# Altium schematic sheet Transceivers.SchDoc
size A; Organization: Machine Intelligence Laboratory; Address1: 1889 Museum Rd; Address2: Room 3001; Address3: Gainesville, FL, 32611; SheetNumber: 3; SheetTotal: 4
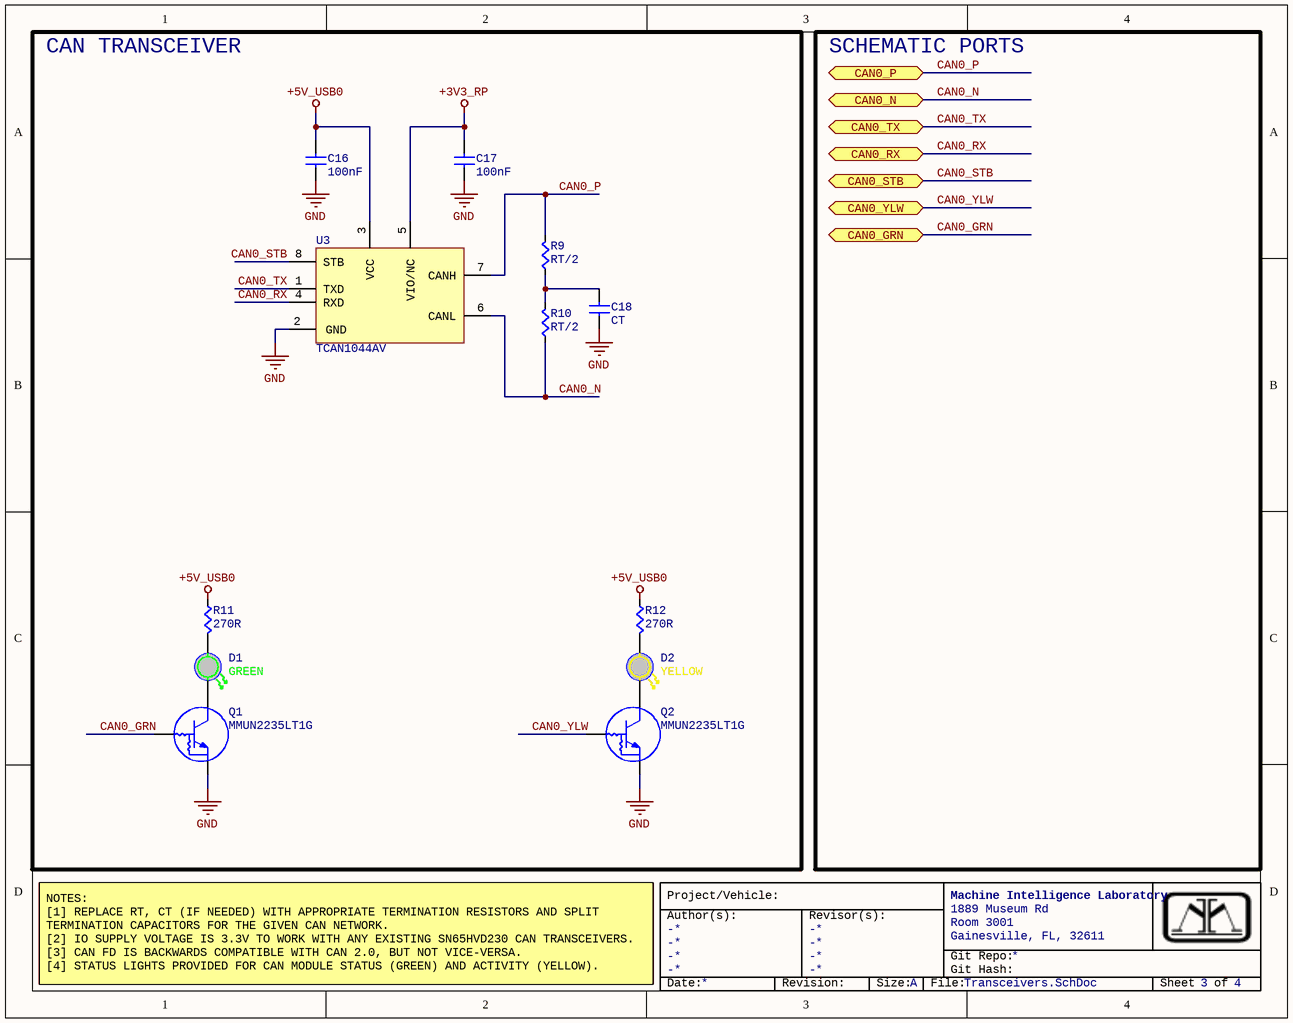
[diagram p0: Transceivers.SchDoc]

## Parts
C16  100nF  [CAPC0603]
C17  100nF  [CAPC0603]
C18  value CT  [CAPC0603]  (hidden comment: Cap)
D1  GREEN  [LED0603]
D2  YELLOW  [LED0603]
Q1  MMUN2235LT1G  [SOT-23-3]
Q2  MMUN2235LT1G  [SOT-23-3]
R9  value RT/2  [RES0603]  (hidden comment: Res)
R10  value RT/2  [RES0603]  (hidden comment: Res)
R11  270R  [RES0603]
R12  270R  [RES0603]
U3  TCAN1044AV  [SOT65P280X110-8N]

## Blocks framed on the sheet
CAN TRANSCEIVER: C16-C18 D1 D2 Q1 Q2 R9-R12 U3

## Ports
CAN0_GRN (bidir, see Connectors[8A], Microcontroller[2D]), CAN0_N (bidir, see Connectors[8A]), CAN0_P (bidir, see Connectors[8A]), CAN0_RX (bidir, see Microcontroller[2C]), CAN0_STB (bidir, see Microcontroller[2C]), CAN0_TX (bidir, see Microcontroller[2C]), CAN0_YLW (bidir, see Connectors[8B], Microcontroller[2C])

## Nets
+3V3_RP: C17.2(B) U3.5(VIO/NC)
+5V_USB0: C16.2(B) R11.2(B) R12.2(B) U3.3(VCC)
GND: C16.1(A) C17.1(A) C18.2(B) Q1.2(E) Q2.2(E) U3.2(GND)
CAN0_GRN: Q1.1(B) ; port CAN0_GRN
CAN0_N: R10.2(B) U3.6(CANL) ; port CAN0_N
CAN0_P: R9.1(A) U3.7(CANH) ; port CAN0_P
CAN0_RX: U3.4(RXD) ; port CAN0_RX
CAN0_STB: U3.8(STB) ; port CAN0_STB
CAN0_TX: U3.1(TXD) ; port CAN0_TX
CAN0_YLW: Q2.1(B) ; port CAN0_YLW
NetC18_1: C18.1(A) R9.2(B) R10.1(A)
NetD1_A: D1.A R11.1(A)
NetD1_C: D1.C Q1.3(C)
NetD2_A: D2.A R12.1(A)
NetD2_C: D2.C Q2.3(C)

## Notes on the sheet
- SCHEMATIC PORTS
- NOTES:
  [1] REPLACE RT, CT (IF NEEDED) WITH APPROPRIATE TERMINATION RESISTORS AND SPLIT TERMINATION CAPACITORS FOR THE GIVEN CAN NETWORK.
  [2] IO SUPPLY VOLTAGE IS 3.3V TO WORK WITH ANY EXISTING SN65HVD230 CAN TRANSCEIVERS.
  [3] CAN FD IS BACKWARDS COMPATIBLE WITH CAN 2.0, BUT NOT VICE-VERSA.
  [4] STATUS LIGHTS PROVIDED FOR CAN MODULE STATUS (GREEN) AND ACTIVITY (YELLOW).
- Project/Vehicle:
- PLACE NOTES BOX HERE
- Author(s):
- -
- Revisor(s):
- Git Repo:
- Git Hash:
- Date:
- Revision:
- Size:
- A
- File:
- Sheet
- of

## Library data of the parts
C16 C17 = CC0603KRX7R7BB104: Ceramic Capacitor, Multilayer, Cera; Manufacturer: Yageo; Multilayer: Yes; Tolerance  (fill in as +-): 10%; Rated DC Voltage (URdc): 16V; Temperature Characteristics Code: X7R; Part Number: CC0603KRX7R7BB104; Category: Ceramic Capacitors; Stock 1: 11347706; Pricing 1: 1=0.1, 10=0.042, 50=0.0238, 100=0.0; Mounting Technology: Surface Mount; Pins: 2; Package Shape: Rectangular; Case/Package: 0603; Terminal Finish: Nickel; Min Operating Temperature: -55°C; Max Operating Temperature: 125°C; JESD-609 Code: e3; Packaging: Tape and Reel; Value: 100nF; Termination: Wraparound; Reach SVHC Compliant: Yes; RoHS Compliant: Yes; ComponentLink1URL: https://datasheet.ciiva.com:443/pdf; ComponentLink1Description: https://datasheet.ciiva.com:443/pdf; ComponentLink2URL: https://datasheet.ciiva.com/11786/0; ComponentLink2Description: https://datasheet.ciiva.com/11786/0; ComponentLink3URL: https://datasheet.ciiva.com/8033/70; ComponentLink3Description: https://datasheet.ciiva.com/8033/70; ComponentLink4URL: https://datasheet.ciiva.com/7978/14; ComponentLink4Description: https://datasheet.ciiva.com/7978/14; ComponentLink5URL: https://datasheet.ciiva.com/28450/1; ComponentLink5Description: https://datasheet.ciiva.com/28450/1; ComponentLink6URL: https://datasheet.ciiva.com/46430/1; ComponentLink6Description: https://datasheet.ciiva.com/46430/1; ComponentLink7URL: https://datasheet.ciiva.com/144/mlc; ComponentLink7Description: https://datasheet.ciiva.com/144/mlc; ComponentLink8URL: https://datasheet.ciiva.com/144/mlc; ComponentLink8Description: https://datasheet.ciiva.com/144/mlc; ComponentLink9URL: https://datasheet.ciiva.com/144/mlc; ComponentLink9Description: https://datasheet.ciiva.com/144/mlc; Supplier Part Number 1: 311-1088-1-ND; Manufacturer Part Number: CC0603KRX7R7BB104; RoHS: Yes; Package Style: SMTMeter; Supplier 1: Digikey; Dielectric Material: Ceramic; Capacitor Type: Ceramic; Tolerance (fill in as +-): 10%; Length: 1.6mm; Width: 0.8mm; Height: 0.8mm; ComponentLink10URL: https://datasheet.ciiva.com/8033/17; ComponentLink10Description: https://datasheet.ciiva.com/8033/17; ComponentLink11URL: https://datasheet.ciiva.com/13395/u; ComponentLink11Description: https://datasheet.ciiva.com/13395/u; ComponentLink12URL: https://datasheet.ciiva.com/11464/u; ComponentLink12Description: https://datasheet.ciiva.com/11464/u; ComponentLink13URL: https://datasheet.ciiva.com/15165/g; ComponentLink13Description: https://datasheet.ciiva.com/15165/g; ComponentLink14URL: https://datasheet.ciiva.com:443/pdfs/VipMasterIC/IC/YAGO/YAGO-S-A0003557223; ComponentLink14Description: https://datasheet.ciiva.com:443/pdfs/VipMasterIC/IC/YAGO/YAGO-S-A0003557223; ComponentLink15URL: https://datasheet.ciiva.com/11786/0900766b80d84f1d-11786077.pdf?src-supplie; ComponentLink15Description: https://datasheet.ciiva.com/11786/0900766b80d84f1d-11786077.pdf?src-supplie; ComponentLink16URL: https://datasheet.ciiva.com/8033/70765-8033799.pdf?src-supplier=Element14; ComponentLink16Description: https://datasheet.ciiva.com/8033/70765-8033799.pdf?src-supplier=Element14; ComponentLink17URL: https://datasheet.ciiva.com/7978/1489800-7978141.pdf?src-supplier=Element14; ComponentLink17Description: https://datasheet.ciiva.com/7978/1489800-7978141.pdf?src-supplier=Element14; ComponentLink18URL: https://datasheet.ciiva.com/28450/1489800-28450552.pdf?src-supplier=Element
D1 = 150060VS75000: Single Color LED, Bright Green, Wat; Manufacturer: Wurth Electronics; Shape: Rectangular; Lens Style: WATER CLEAR; Forward Current: 30mA; Luminous Intensity-Nom: 40mcd; Channels: 1; Viewing Angle: 140°; Overall Height: 0.7mm; Part Number: 150060VS75000; Category: LEDs; Stock 1: 38675; Pricing 1: 1=0.15, 50=0.142, 100=0.122, 500=0.; Mounting Technology: Surface Mount; Pins: 2; Min Operating Temperature: -40°C; Max Operating Temperature: 85°C; Packaging: Tape and Reel; Reach SVHC Compliant: Yes; RoHS Compliant: Yes; ComponentLink1URL: https://datasheet.ciiva.com:443/pdf; ComponentLink1Description: https://datasheet.ciiva.com:443/pdf; ComponentLink2URL: https://datasheet.ciiva.com/29562/1; ComponentLink2Description: https://datasheet.ciiva.com/29562/1; Supplier Part Number 1: 732-4980-1-ND; Manufacturer Part Number: 150060VS75000; RoHS: Yes; Supplier 1: Digikey; Color: Green; Optoelectronic Device Type: SINGLE COLOR LED; Size: 1.1mm; Terminal Pitch: 1.6mm
D2 = 150060YS75000: Single Color LED, Yellow, Water Cle; Manufacturer: Wurth Electronics; Shape: Rectangular; Lens Style: WATER CLEAR; Forward Current: 30mA; Luminous Intensity-Nom: 120mcd; Channels: 1; Viewing Angle: 140°; Overall Height: 0.7mm; Part Number: 150060YS75000; Category: LEDs; Stock 1: 50357; Pricing 1: 1=0.15, 50=0.142, 100=0.122, 500=0.; Mounting Technology: Surface Mount; Pins: 2; Min Operating Temperature: -40°C; Max Operating Temperature: 85°C; Packaging: Tape and Reel; Reach SVHC Compliant: Yes; RoHS Compliant: Yes; ComponentLink1URL: https://datasheet.ciiva.com:443/pdf; ComponentLink1Description: https://datasheet.ciiva.com:443/pdf; ComponentLink2URL: https://datasheet.ciiva.com/23843/1; ComponentLink2Description: https://datasheet.ciiva.com/23843/1; ComponentLink3URL: https://datasheet.ciiva.com/29279/7; ComponentLink3Description: https://datasheet.ciiva.com/29279/7; ComponentLink4URL: https://datasheet.ciiva.com/22656/1; ComponentLink4Description: https://datasheet.ciiva.com/22656/1; ComponentLink5URL: https://datasheet.ciiva.com/29563/1; ComponentLink5Description: https://datasheet.ciiva.com/29563/1; ComponentLink6URL: https://datasheet.ciiva.com/29563/1; ComponentLink6Description: https://datasheet.ciiva.com/29563/1; ComponentLink7URL: https://datasheet.ciiva.com/48430/1; ComponentLink7Description: https://datasheet.ciiva.com/48430/1; Supplier Part Number 1: 732-4981-1-ND; Manufacturer Part Number: 150060YS75000; RoHS: Yes; Supplier 1: Digikey; Color: Yellow; Optoelectronic Device Type: SINGLE COLOR LED; Size: 1.1mm; Terminal Pitch: 1.6mm
Q1 Q2 = MMUN2235LT1G: Small Signal Bipolar Transistor, 0.; Manufacturer: ON Semiconductor; Package Body Material: Plastic; Transistor Element Material: SILICON; Polarity/Channel Type: NPN; Max Collector Current: 100mA; Collector-emitter Voltage-Max: 50V; DC Current Gain-Min (hFE): 80; Number of Elements: 1; Power Dissipation-Max (Abs): 400mW; Transistor Application: SWITCHING; JEDEC-95 Code: TO-236AB; Part Number: MMUN2235LT1G; Category: BJTs; Stock 1: 373000; Pricing 1: 1=0.1198, 10=0.0829, 100=0.035, 100; Pins: 3; Package Shape: Rectangular; Terminal Finish: Tin; JESD-609 Code: e3; Reach SVHC Compliant: Yes; RoHS Compliant: Yes; ComponentLink1URL: https://datasheet.ciiva.com:443/pdf; ComponentLink1Description: https://datasheet.ciiva.com:443/pdf; ComponentLink2URL: http://www.mouser.com/ds/2/308/DTC1; ComponentLink2Description: http://www.mouser.com/ds/2/308/DTC1; ComponentLink3URL: http://www.onsemi.com/pub/Collatera; ComponentLink3Description: http://www.onsemi.com/pub/Collatera; ComponentLink4URL: http://www.onsemi.com/pub/Collatera; ComponentLink4Description: http://www.onsemi.com/pub/Collatera; Supplier Part Number 1: MMUN2235LT1G; Manufacturer Part Number: MMUN2235LT1G; RoHS: Yes; Package Style: SMALL OUTLINEMeter; Supplier 1: Arrow Electronics; Moisture Sensitivity Level: 1; JESD-30 Code: R-PDSO-G3; Surface Mount: Yes; Terminal Form: Gull Wing; Terminal Position: DUAL
R11 R12 = RC0603FR-07270RL: Fixed Resistor, Metal Glaze/thick F; Manufacturer: Yageo; Power: 100mW; Rated Temperature: 70°C; Tolerance: 1%; Additional Feature: LASER TRIMMABLE; Temperature Coefficient: 100ppm/°C; Working Voltage: 75V; Package Height: 0.45mm; Package Length: 1.6mm; Package Width: 0.8mm; Part Number: RC0603FR-07270RL; Category: Chip SMD Resistors; Stock 1: 855000; Pricing 1: 5000=0.0015, 50000=0.0014, 150000=0; Mounting Technology: Surface Mount; Pins: 2; Package Shape: Rectangular; Case/Package: 0603; Terminal Finish: Nickel; Min Operating Temperature: -55°C; Max Operating Temperature: 155°C; JESD-609 Code: e3; Resistor Type: FIXED RESISTOR; Packaging: Tape and Reel; Value: 270R; Termination: Wraparound; Technology: METAL GLAZE/THICK FILM; Reach SVHC Compliant: Yes; RoHS Compliant: Yes; ComponentLink1URL: https://datasheet.ciiva.com:443/pdf; ComponentLink1Description: https://datasheet.ciiva.com:443/pdf; ComponentLink2URL: https://datasheet.ciiva.com/11808/0; ComponentLink2Description: https://datasheet.ciiva.com/11808/0; ComponentLink3URL: https://datasheet.ciiva.com/2455/py; ComponentLink3Description: https://datasheet.ciiva.com/2455/py; ComponentLink4URL: https://datasheet.ciiva.com/2455/py; ComponentLink4Description: https://datasheet.ciiva.com/2455/py; ComponentLink5URL: https://datasheet.ciiva.com/2455/py; ComponentLink5Description: https://datasheet.ciiva.com/2455/py; ComponentLink6URL: https://datasheet.ciiva.com/15189/g; ComponentLink6Description: https://datasheet.ciiva.com/15189/g; ComponentLink7URL: https://datasheet.ciiva.com/7746/44; ComponentLink7Description: https://datasheet.ciiva.com/7746/44; ComponentLink8URL: https://datasheet.ciiva.com/7746/44; ComponentLink8Description: https://datasheet.ciiva.com/7746/44; Supplier Part Number 1: 7559610; Manufacturer Part Number: RC0603FR-07270RL; RoHS: Yes; Construction: Chip; Package Style: SMTMeter; Supplier 1: Future Electronics
U3 = TCAN1044AVDDFRQ1: 1/1 Transceiver Half CANbus TSOT-23-8; Supplier 1: Digikey; Supplier Part Number 1: 296-TCAN1057ADDFRQ1CT-ND
C18 = Cap: Supplier 1: Digi-Key; Supplier Part Number 1: 1276-1000-1-ND
R9 R10 = Res: Supplier 1: Digi-Key; Supplier Part Number 1: RMCF0603JT10K0CT-ND